# Altium schematic sheet LCD_KB_SND_BTN.SchDoc
size A4
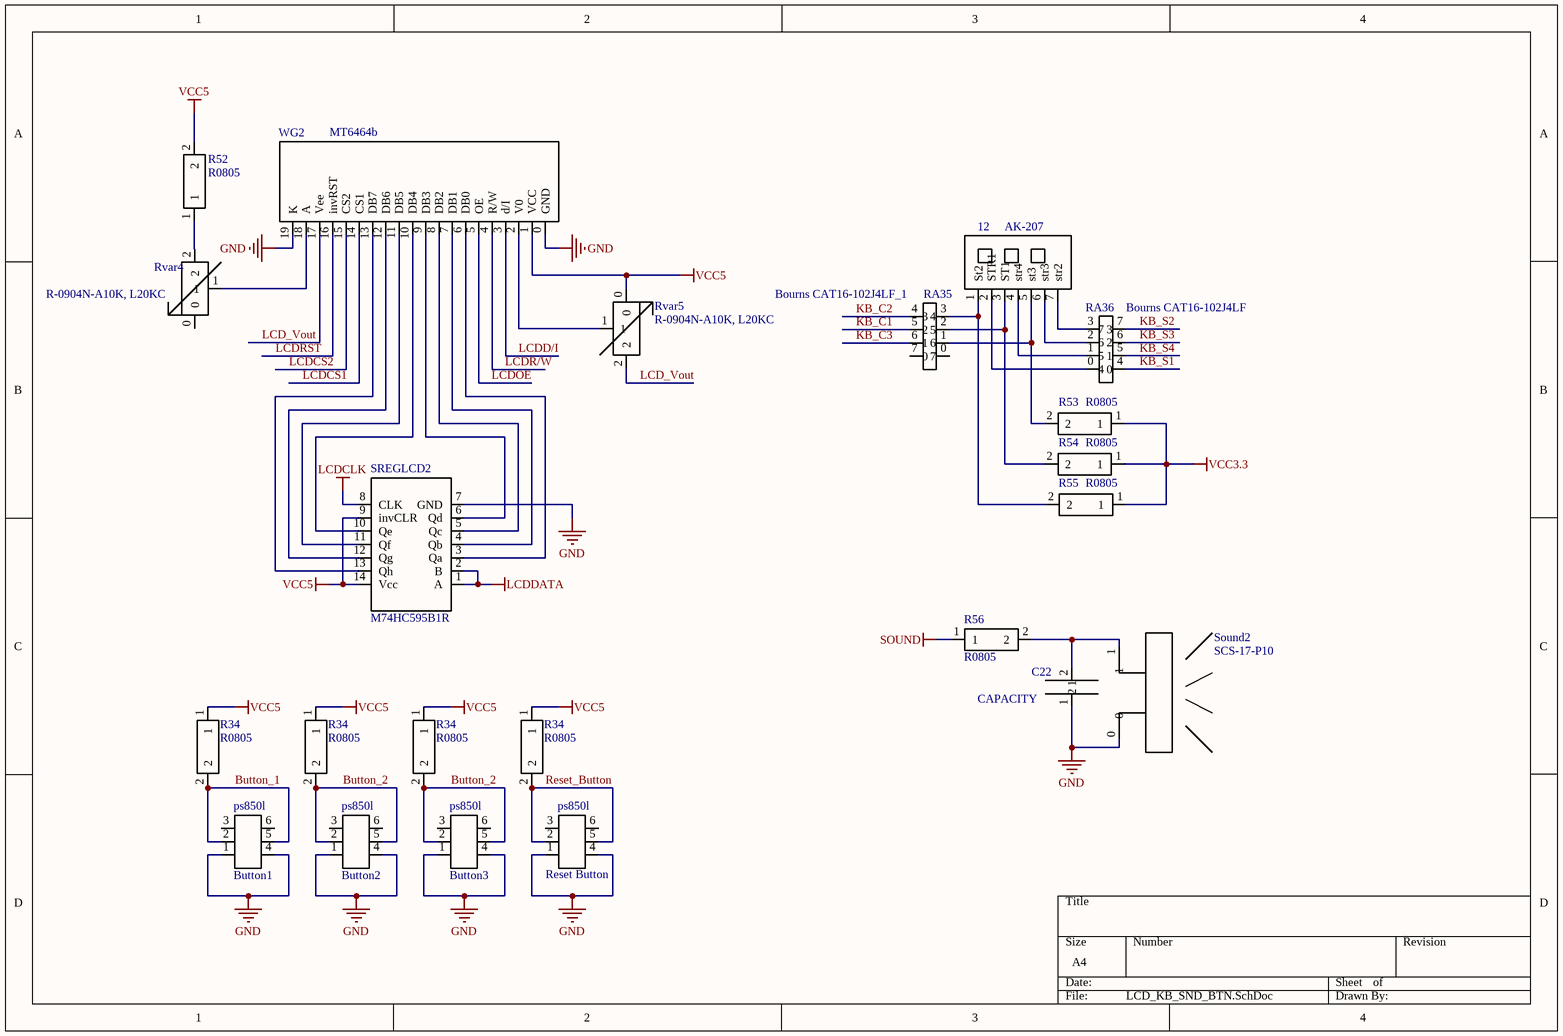
[diagram p0: LCD_KB_SND_BTN.SchDoc]

## Parts
(Parts that share a designator on the sheet are numbered #1, #2 ... from top to bottom, then left to right.)
12  AK-207  [AK-207]
C22  CAPACITY  [R0805]
ps850l#1  Button1  [ps850l]
ps850l#2  Button2  [ps850l]
ps850l#3  Button3  [ps850l]
ps850l#4  Reset Button  [ps850l]
R34#1  R0805  [R0805]
R34#2  R0805  [R0805]
R34#3  R0805  [R0805]
R34#4  R0805  [R0805]
R52  R0805  [R0805]
R53  R0805  [R0805]
R54  R0805  [R0805]
R55  R0805  [R0805]
R56  R0805  [R0805]
RA35  Bourns CAT16-102J4LF_1  [CAT16-102J4LF_2]
RA36  Bourns CAT16-102J4LF  [CAT16-102J4LF]
Rvar4  R-0904N-A10K, L20KC  [R-0904N-A10K, L20KC]
Rvar5  R-0904N-A10K, L20KC  [R-0904N-A10K, L20KC]
Sound2  SCS-17-P10  [SCS-17-P10]
SREGLCD2  M74HC595B1R  [SN74HC164DRX]
WG2  MT6464b  [WG12864A]

## Nets
GND: C22.1 ps850l#1.1 ps850l#1.4 ps850l#2.1 ps850l#2.4 ps850l#3.1 ps850l#3.4 ps850l#4.1 ps850l#4.4 Sound2.0 SREGLCD2.7(GND) WG2.0(GND) WG2.19(K)
LCDCLK: SREGLCD2.8(CLK)
LCDDATA: SREGLCD2.1(A) SREGLCD2.2(B)
SOUND: R56.1
VCC3.3: R53.1 R54.1 R55.1
VCC5: R34#1.1 R34#2.1 R34#3.1 R34#4.1 R52.2 Rvar5.0 SREGLCD2.9(invCLR) SREGLCD2.14(Vcc) WG2.1(VCC)
Button_1: ps850l#1.2 ps850l#1.5 R34#1.2
Button_2: ps850l#2.2 ps850l#2.5 ps850l#3.2 ps850l#3.5 R34#2.2 R34#3.2
KB_C1: RA35.5
KB_C2: RA35.4
KB_C3: RA35.6
KB_S1: RA36.4
KB_S2: RA36.7
KB_S3: RA36.6
KB_S4: RA36.5
LCD_Vout: Rvar5.2 WG2.17(Vee)
LCDCS1: WG2.14(CS1)
LCDCS2: WG2.15(CS2)
LCDD/I: WG2.3(d/I)
LCDOE: WG2.5(OE)
LCDR/W: WG2.4(R/W)
LCDRST: WG2.16(invRST)
Reset_Button: ps850l#4.2 ps850l#4.5 R34#4.2
Net12_1: 12.1(St2) R55.2 RA35.3
Net12_2: 12.2(STR1) RA36.0
Net12_3: 12.3(ST1) R54.2 RA35.2
Net12_4: 12.4(str4) RA36.1
Net12_5: 12.5(st3) R53.2 RA35.1
Net12_6: 12.6(str3) RA36.2
Net12_7: 12.7(str2) RA36.3
NetC22_2: C22.2 R56.2 Sound2.1
NetR52_1: R52.1 Rvar4.2
NetRvar4_1: Rvar4.1 WG2.18(A)
NetRvar5_1: Rvar5.1 WG2.2(V0)
NetSREGLCD2_3: SREGLCD2.3(Qa) WG2.6(DB0)
NetSREGLCD2_4: SREGLCD2.4(Qb) WG2.7(DB1)
NetSREGLCD2_5: SREGLCD2.5(Qc) WG2.8(DB2)
NetSREGLCD2_6: SREGLCD2.6(Qd) WG2.9(DB3)
NetSREGLCD2_10: SREGLCD2.10(Qe) WG2.10(DB4)
NetSREGLCD2_11: SREGLCD2.11(Qf) WG2.11(DB5)
NetSREGLCD2_12: SREGLCD2.12(Qg) WG2.12(DB6)
NetSREGLCD2_13: SREGLCD2.13(Qh) WG2.13(DB7)

Not connected (* = marked no-connect by the designer): ps850l#1 3 6; ps850l#2 3 6; ps850l#3 3 6; ps850l#4 3 6; RA35 0 7; Rvar4 0

## Library data of the parts
ps850l#1-ps850l#4 = ps850l
Rvar5 = R-0904N-A10K, L20KC: 10k